# Altium schematic sheet Val_fancontroller.SchDoc
size A; SheetNumber: 1; SheetTotal: 1
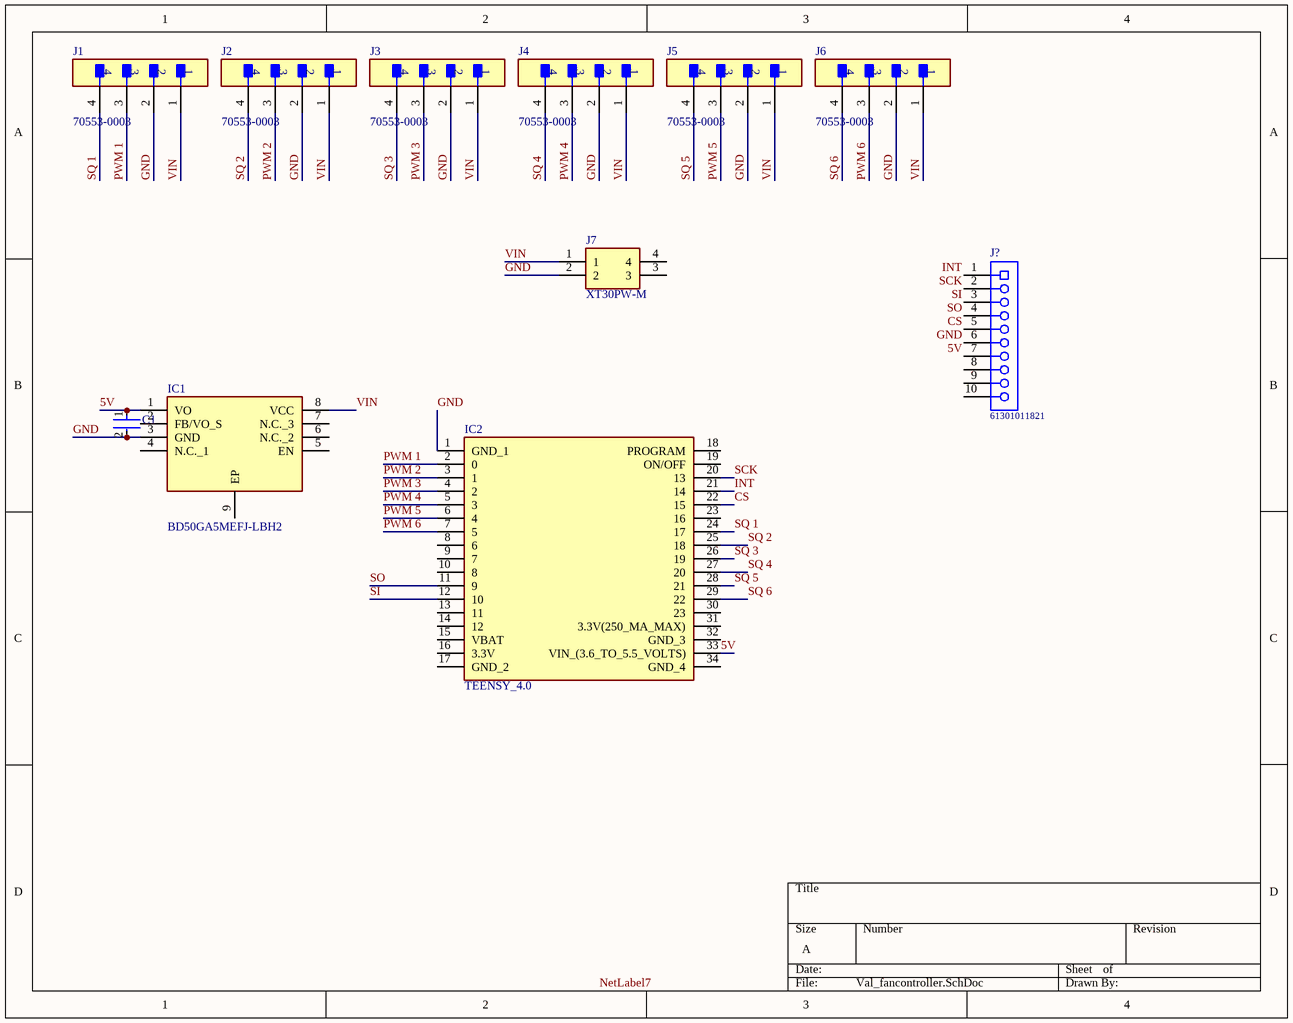
[diagram p0: Val_fancontroller.SchDoc]

## Parts
C1  GRM55DR72E105KW01L  [FP-GRM55D-0_4-IPC_A]  (value not drawn)
IC1  BD50GA5MEFJ-LBH2  [SOIC127P600X100-9N]
IC2  TEENSY_4.0  [TEENSY40]
J1  70553-0003  [FP-70553-0003-MFG]
J2  70553-0003  [FP-70553-0003-MFG]
J3  70553-0003  [FP-70553-0003-MFG]
J4  70553-0003  [FP-70553-0003-MFG]
J5  70553-0003  [FP-70553-0003-MFG]
J6  70553-0003  [FP-70553-0003-MFG]
J7  XT30PW-M  [XT30PWM]
J?  61301011821  [61301011821]

## Nets
5V: C1.1 IC1.1(VO) IC2.33(VIN_(3.6_TO_5.5_VOLTS)) J?.7
CS: IC2.22(15) J?.5
GND: C1.2 IC1.3(GND) IC2.1(GND_1) J1.2 J2.2 J3.2 J4.2 J5.2 J6.2 J7.2 J?.6
INT: IC2.21(14) J?.1
PWM 1: IC2.2(0) J1.3
PWM 2: IC2.3(1) J2.3
PWM 3: IC2.4(2) J3.3
PWM 4: IC2.5(3) J4.3
PWM 5: IC2.6(4) J5.3
PWM 6: IC2.7(5) J6.3
SCK: IC2.20(13) J?.2
SI: IC2.12(10) J?.3
SO: IC2.11(9) J?.4
SQ 1: IC2.24(17) J1.4
SQ 2: IC2.25(18) J2.4
SQ 3: IC2.26(19) J3.4
SQ 4: IC2.27(20) J4.4
SQ 5: IC2.28(21) J5.4
SQ 6: IC2.29(22) J6.4
VIN: IC1.8(VCC) J1.1 J2.1 J3.1 J4.1 J5.1 J6.1 J7.1

Not connected (* = marked no-connect by the designer): IC1 2(FB/VO_S) 4(N.C._1) 5(EN) 6(N.C._2) 7(N.C._3) 9(EP); IC2 8(6) 9(7) 10(8) 13(11) 14(12) 15(VBAT) 16(3.3V) 17(GND_2) 18(PROGRAM) 19(ON/OFF) 23(16) 30(23) 31(3.3V(250_MA_MAX)) 32(GND_3) 34(GND_4); J7 3 4; J? 8 9 10

## Notes on the sheet
- Labels drawn without touching a wire or pin: NetLabel7

## Library data of the parts
C1 = CMP-2000-06370-2: Chip Multilayer Ceramic Capacitors for General Purpose, 2220, 1.0uF, X7R, 15%, 10%, 250V; Capacitance: 1uF; Width: 5mm; Height: 2mm; Case Code (Imperial): 2220; Voltage Rating (DC): 250V; Max Operating Temperature: 125°C; Number of Pins: 2; Min Operating Temperature: -55°C; Termination: SMD/SMT; Case/Package: 2220; Dielectric: X7R; Material: Ceramic; REACH SVHC: No SVHC; Voltage: 250V; Packaging: Tape and Reel; Thickness: 0.087inch; Depth: 5mm; Package Quantity: 1; Tolerance: 10%; Mount: Surface Mount; Voltage Rating: 250V; Length: 5.7mm; Case Code (Metric): 5750; Lead Free: Lead Free
IC1 = BD50GA5MEFJ-LBH2: Integrated Circuit; Manufacturer_Name: ROHM Semiconductor; Datasheet Link: https://componentsearchengine.com/Datasheets/2/BD50GA5MEFJ-LBH2.pdf; Height: 1mm; Manufacturer_Part_Number: BD50GA5MEFJ-LBH2
IC2 = TEENSY_4.0: Integrated Circuit; Manufacturer_Name: Teensy; Manufacturer_Part_Number: TEENSY 4.0; Datasheet Link: https://www.pjrc.com/store/teensy40.html; Height: 4.64mm
J1-J6 = CMP-04776-000256-1: CONN HEADER R/A 4POS 2.54MM; Number of Positions: 4; Glow Wire Compliant: Non-compliant; Contact Resistance: 30mR; Voltage Rating: 250V; Gender: Male; Insulation Resistance: 1GR; Current Rating: 3A; Approvals: UL; Housing Color: Black; Lead Free: Lead Free; Contact Material: Bronze; Flammability Rating: UL94 V-0; Contact Plating: Gold; Number of Circuits: 4; Number of Contacts: 4; Number of Rows: 1; Mount: Through Hole; Material: Brass; Voltage Rating (DC): 250V; Orientation: Right Angle; Pitch: 2.54mm; Packaging: Rail/Tube; Max Operating Temperature: 105°C; Termination: Through Hole; Series: 70553; Min Operating Temperature: -40°C; Color: Black; Housing Material: Polycyclohexylenedimethylene; Package Quantity: 1680; ELV: Compliant
J7 = XT30PW-M: Connector; Manufacturer_Name: Amass; Datasheet Link: https://www.tme.eu/sl/Document/ce4077e36b79046da520ca73227e15de/XT30PW%20SPEC.pdf; Height: 5mm; Manufacturer_Part_Number: XT30PW-M
J? = CMP-1502-01332-1: THT Vertical Socket Header WR-PHD, Pitch 2.54 mm, Single Row, 10 pins; Manufacturer: Wurth Elektronik; Rated Current: 3A; Working Voltage: 250VAC; Gender: Female; Pitch: 2.54mm; Contact Resistance: 20mOhm; Pin Number: 10; Withstanding Voltage: 500VAC; Publisher: WurthElektronik; Orientation: Vertical; Row Number: Single; Package Reference: 61301011821; Packaging: Tray; Datasheet URL: https://katalog.we-online.de/em/datasheet/6130xx11821.pdf; Operating Temperature: -40to125degC; Part Number: 61301011821; Manufacturer URL: http://www.we-online.de; Mounting Technology: THT